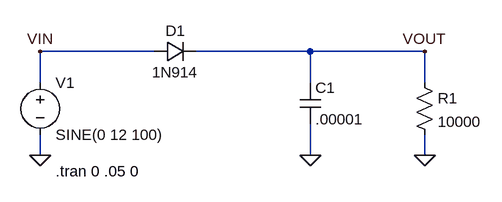
[diagram p0: schematic Half-wave.asc]
Half-wave.asc, the LTspice schematic file:
Version 4
SHEET 1 880 680
WIRE 128 64 -48 64
WIRE 368 64 192 64
WIRE 544 64 368 64
WIRE -48 112 -48 64
WIRE 368 112 368 64
WIRE 544 112 544 64
WIRE -48 224 -48 192
WIRE 368 224 368 176
WIRE 544 224 544 192
FLAG -48 224 0
FLAG -48 64 VIN
FLAG 368 224 0
FLAG 544 224 0
FLAG 544 64 VOUT
SYMBOL voltage -48 96 R0
WINDOW 123 0 0 Left 0
WINDOW 39 0 0 Left 0
SYMATTR InstName V1
SYMATTR Value SINE(0 12 100)
SYMBOL diode 128 80 R270
WINDOW 0 32 32 VTop 0
WINDOW 3 0 32 VBottom 0
SYMATTR InstName D1
SYMATTR Value 1N914
SYMBOL cap 352 112 R0
SYMATTR InstName C1
SYMATTR Value .00001
SYMATTR SpiceLine V=50
SYMBOL res 528 96 R0
SYMATTR InstName R1
SYMATTR Value 10000
SYMATTR SpiceLine pwr=.5
TEXT -24 248 Left 0 !.tran 0 .05 0

The netlist it stands for:
* Half-wave.asc
V1 VIN 0 SINE(0 12 100)
D1 VIN VOUT 1N914
C1 VOUT 0 .00001 V=50
R1 VOUT 0 10000 pwr=.5
.model D D
.lib standard.dio
.tran 0 .05 0
.backanno
.end

* Results of the author's LTspice run, read from the files saved beside the schematic
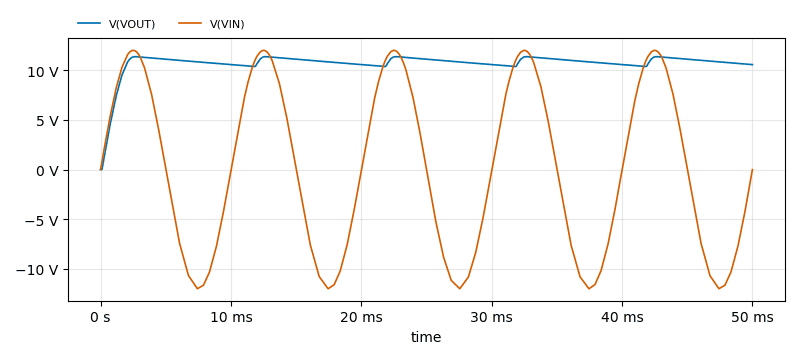
[diagram p1: Transient Analysis of Half-wave.asc, plotted from the saved traces]
* Transient Analysis, 1 run:
*   V(VOUT): min 0 V, max 11.36 V, average 10.69 V, rms 10.76 V, last 10.56 V
*   V(VIN): min -11.99 V, max 12 V, average 30.61 mV, rms 8.804 V, last 0 V